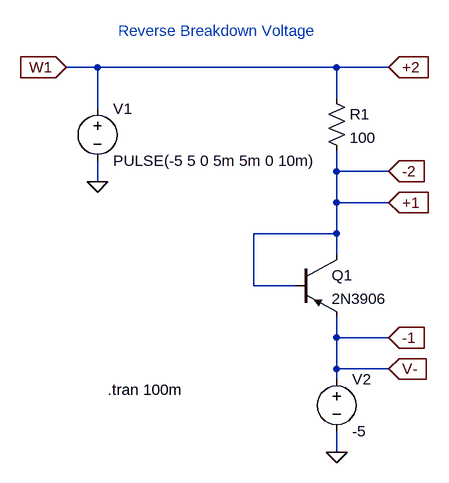
[diagram p0: schematic rev_breakdown_voltage.asc]
rev_breakdown_voltage.asc, the LTspice schematic file:
Version 4
SHEET 1 880 680
WIRE -64 -128 -112 -128
WIRE 304 -128 -64 -128
WIRE 384 -128 304 -128
WIRE 304 -80 304 -128
WIRE -64 -64 -64 -128
WIRE 304 32 304 0
WIRE 384 32 304 32
WIRE -64 48 -64 16
WIRE 304 80 304 32
WIRE 384 80 304 80
WIRE 304 128 304 80
WIRE 304 128 176 128
WIRE 304 160 304 128
WIRE 176 208 176 128
WIRE 240 208 176 208
WIRE 304 288 304 256
WIRE 384 288 304 288
WIRE 304 336 304 288
WIRE 384 336 304 336
WIRE 304 352 304 336
WIRE 304 464 304 432
FLAG -112 -128 W1
IOPIN -112 -128 In
FLAG 384 -128 +2
IOPIN 384 -128 In
FLAG 384 32 -2
IOPIN 384 32 In
FLAG 384 80 +1
IOPIN 384 80 In
FLAG 384 288 -1
IOPIN 384 288 In
FLAG -64 48 0
FLAG 384 336 V-
IOPIN 384 336 In
FLAG 304 464 0
SYMBOL res 288 -96 R0
SYMATTR InstName R1
SYMATTR Value 100
SYMBOL voltage -64 -80 R0
WINDOW 123 0 0 Left 0
WINDOW 39 0 0 Left 0
SYMATTR InstName V1
SYMATTR Value PULSE(-5 5 0 5m 5m 0 10m)
SYMBOL voltage 304 336 R0
WINDOW 123 0 0 Left 0
WINDOW 39 0 0 Left 0
SYMATTR InstName V2
SYMATTR Value -5
SYMBOL pnp 240 160 R0
SYMATTR InstName Q1
SYMATTR Value 2N3906
TEXT -48 368 Left 2 !.tran 100m
TEXT -32 -184 Left 2 ;Reverse Breakdown Voltage

The netlist it stands for:
* rev_breakdown_voltage.asc
R1 +2 +1 100
V1 +2 0 PULSE(-5 5 0 5m 5m 0 10m)
V2 V- 0 -5
Q1 +1 +1 V- 0 2N3906
.model NPN NPN
.model PNP PNP
.lib standard.bjt
.tran 100m
* Reverse Breakdown Voltage
.backanno
.end